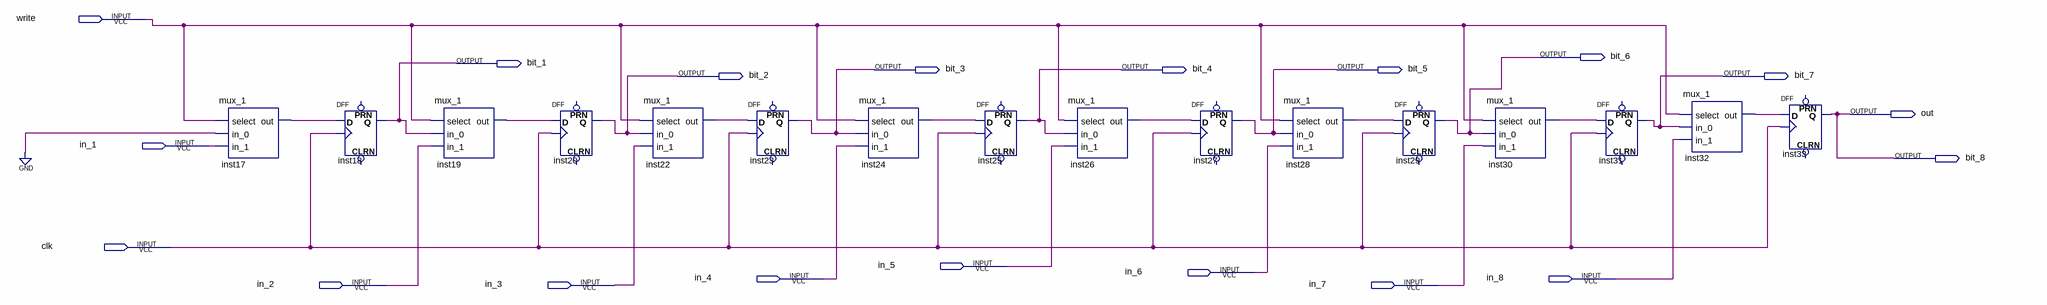
[diagram p0: schematic sheet]
// Quartus schematic replaceReg.bdf as structural Verilog: 16 symbols, 19 pins
module replaceReg (
  input  write,
  input  in_1,
  input  clk,
  input  in_5,
  input  in_6,
  input  in_4,
  input  in_8,
  input  in_2,
  input  in_3,
  input  in_7,
  output bit_6,
  output bit_1,
  output bit_3,
  output bit_4,
  output bit_5,
  output bit_2,
  output bit_7,
  output out,
  output bit_8
);

  wire inst17_out, inst19_out, inst22_out, inst24_out, inst26_out, inst28_out, inst30_out, inst32_out;

  mux_1 inst17 (.select(write), .in_0(1'b0), .in_1(in_1), .out(inst17_out));
  DFF inst18 (.CLK(clk), .D(inst17_out), .Q(bit_1));  // open: CLRN, PRN
  mux_1 inst19 (.select(write), .in_0(bit_1), .in_1(in_2), .out(inst19_out));
  DFF inst20 (.CLK(clk), .D(inst19_out), .Q(bit_2));  // open: CLRN, PRN
  mux_1 inst22 (.select(write), .in_0(bit_2), .in_1(in_3), .out(inst22_out));
  DFF inst23 (.CLK(clk), .D(inst22_out), .Q(bit_3));  // open: CLRN, PRN
  mux_1 inst24 (.select(write), .in_0(bit_3), .in_1(in_4), .out(inst24_out));
  DFF inst25 (.CLK(clk), .D(inst24_out), .Q(bit_4));  // open: CLRN, PRN
  mux_1 inst26 (.select(write), .in_0(bit_4), .in_1(in_5), .out(inst26_out));
  DFF inst27 (.CLK(clk), .D(inst26_out), .Q(bit_5));  // open: CLRN, PRN
  mux_1 inst28 (.select(write), .in_0(bit_5), .in_1(in_6), .out(inst28_out));
  DFF inst29 (.CLK(clk), .D(inst28_out), .Q(bit_6));  // open: CLRN, PRN
  mux_1 inst30 (.select(write), .in_0(bit_6), .in_1(in_7), .out(inst30_out));
  DFF inst31 (.CLK(clk), .D(inst30_out), .Q(bit_7));  // open: CLRN, PRN
  mux_1 inst32 (.select(write), .in_0(bit_7), .in_1(in_8), .out(inst32_out));
  DFF inst33 (.CLK(clk), .D(inst32_out), .Q(bit_8));  // open: CLRN, PRN

  assign out = bit_8;
endmodule
